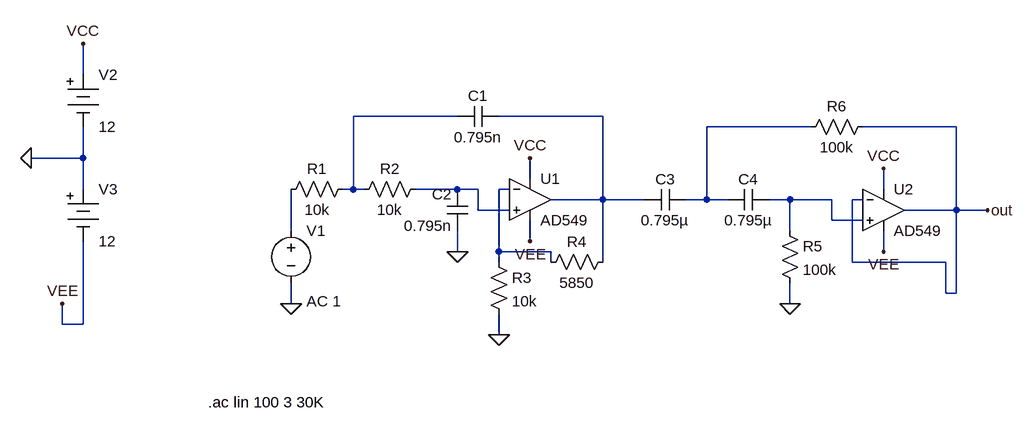
[diagram p0: schematic nas.asc]
nas.asc, the LTspice schematic file:
Version 4
SHEET 1 1400 680
WIRE -240 -48 -240 -96
WIRE 336 16 176 16
WIRE 560 16 400 16
WIRE 880 32 720 32
WIRE 1104 32 960 32
WIRE -240 80 -240 32
WIRE -240 80 -320 80
WIRE 448 112 448 80
WIRE -240 128 -240 80
WIRE 176 128 176 16
WIRE 176 128 160 128
WIRE 192 128 176 128
WIRE 336 128 272 128
WIRE 368 128 336 128
WIRE 416 128 400 128
WIRE 992 128 992 96
WIRE 560 144 560 16
WIRE 560 144 480 144
WIRE 624 144 560 144
WIRE 720 144 720 32
WIRE 720 144 688 144
WIRE 752 144 720 144
WIRE 848 144 816 144
WIRE 912 144 848 144
WIRE 960 144 944 144
WIRE 368 160 368 128
WIRE 416 160 368 160
WIRE 1104 160 1104 32
WIRE 1104 160 1024 160
WIRE 1152 160 1104 160
WIRE 912 176 912 144
WIRE 960 176 912 176
WIRE 80 192 80 128
WIRE 848 192 848 144
WIRE 448 208 448 176
WIRE 336 224 336 192
WIRE 400 224 400 128
WIRE 480 224 400 224
WIRE 992 224 992 192
WIRE 400 240 400 224
WIRE 480 240 480 224
WIRE 560 240 560 144
WIRE 944 240 944 144
WIRE 1088 240 944 240
WIRE 1088 288 1088 240
WIRE 1104 288 1104 160
WIRE 1104 288 1088 288
WIRE 80 304 80 272
WIRE 848 304 848 272
WIRE -272 336 -272 304
WIRE -240 336 -240 208
WIRE -240 336 -272 336
WIRE 400 352 400 320
FLAG 336 224 0
FLAG 80 304 0
FLAG 400 352 0
FLAG -240 -96 VCC
FLAG -272 304 VEE
FLAG -320 80 0
FLAG 448 80 VCC
FLAG 448 208 VEE
FLAG 1152 160 out
FLAG 992 96 VCC
FLAG 992 224 VEE
FLAG 848 304 0
SYMBOL res 176 112 R90
WINDOW 0 0 56 VBottom 2
WINDOW 3 32 56 VTop 2
SYMATTR InstName R1
SYMATTR Value 10k
SYMBOL res 288 112 R90
WINDOW 0 0 56 VBottom 2
WINDOW 3 32 56 VTop 2
SYMATTR InstName R2
SYMATTR Value 10k
SYMBOL cap 400 0 R90
WINDOW 0 0 32 VBottom 2
WINDOW 3 32 32 VTop 2
SYMATTR InstName C1
SYMATTR Value 0.795n
SYMBOL cap 352 192 R180
WINDOW 0 24 56 Left 2
WINDOW 3 24 8 Left 2
SYMATTR InstName C2
SYMATTR Value 0.795n
SYMBOL OpAmps\\AD549 448 80 R0
SYMATTR InstName U1
SYMBOL res 384 224 R0
SYMATTR InstName R3
SYMATTR Value 10k
SYMBOL res 576 224 R90
WINDOW 0 0 56 VBottom 2
WINDOW 3 32 56 VTop 2
SYMATTR InstName R4
SYMATTR Value 5850
SYMBOL voltage 80 176 R0
WINDOW 123 24 124 Left 2
WINDOW 39 0 0 Left 0
SYMATTR Value2 AC 1
SYMATTR InstName V1
SYMATTR Value ""
SYMBOL Misc\\battery -240 -64 R0
SYMATTR InstName V2
SYMATTR Value 12
SYMBOL Misc\\battery -240 112 R0
SYMATTR InstName V3
SYMATTR Value 12
SYMBOL OpAmps\\AD549 992 96 R0
SYMATTR InstName U2
SYMBOL cap 688 128 R90
WINDOW 0 0 32 VBottom 2
WINDOW 3 32 32 VTop 2
SYMATTR InstName C3
SYMATTR Value 0.795µ
SYMBOL cap 752 160 R270
WINDOW 0 32 32 VTop 2
WINDOW 3 0 32 VBottom 2
SYMATTR InstName C4
SYMATTR Value 0.795µ
SYMBOL res 976 16 R90
WINDOW 0 0 56 VBottom 2
WINDOW 3 32 56 VTop 2
SYMATTR InstName R6
SYMATTR Value 100k
SYMBOL res 832 176 R0
SYMATTR InstName R5
SYMATTR Value 100k
TEXT -48 456 Left 2 !.ac lin 100 3 30K

The netlist it stands for:
* nas.asc
R1 N001 N007 10k
R2 N004 N001 10k
C1 N002 N001 0.795n
C2 0 N004 0.795n
XU1 N004 N005 VCC VEE N002 AD549  ; pins In+ In- V+ V- OUT
R3 N005 0 10k
R4 N002 N005 5850
V1 N007 0 AC 1
V2 VCC 0 12
V3 0 VEE 12
XU2 N006 out VCC VEE out AD549  ; pins In+ In- V+ V- OUT
C3 N003 N002 0.795µ
C4 N003 N006 0.795µ
R6 out N003 100k
R5 N006 0 100k
.ac lin 100 3 30K
.backanno
.end